# EAGLE design untitled (EAGLE 9.2.0)
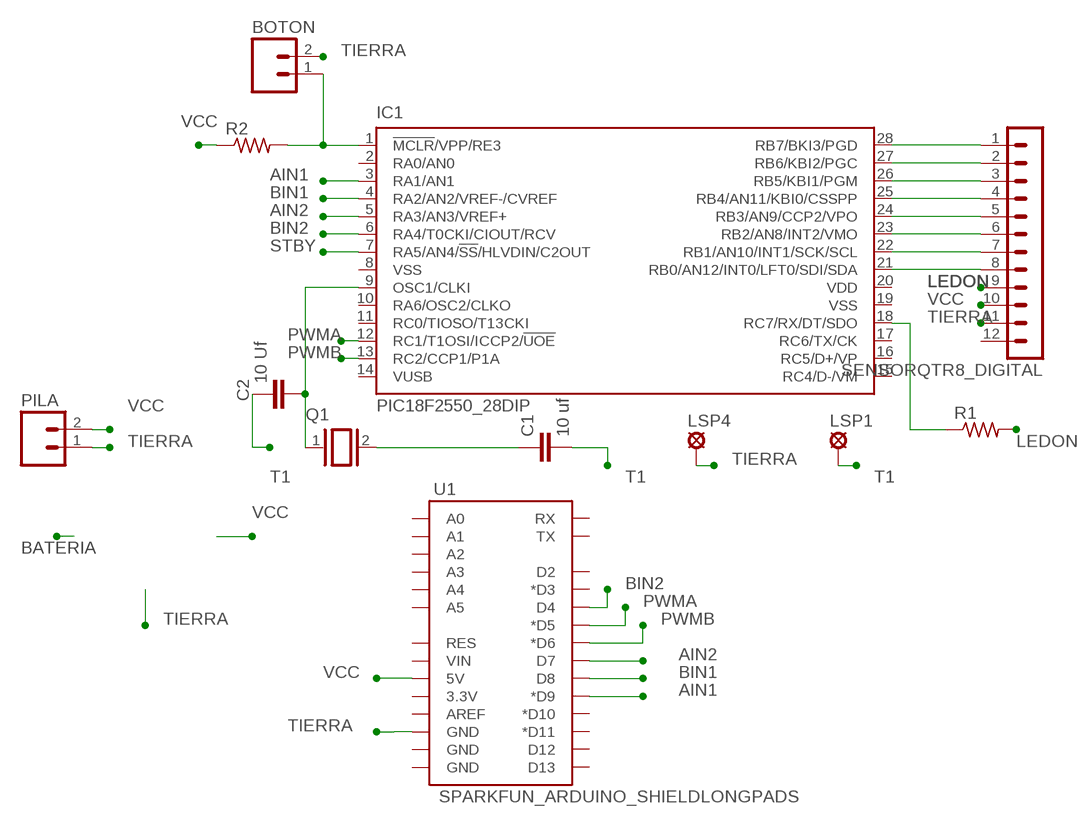
[diagram p0: schematic, sheet 1]

## Parts
BOTON  MA02  [02PA]
C1  10 uf  C-EU025-024X044  [C025-024X044]
C2  10 Uf  C-EU025-024X044  [C025-024X044]
IC1  PIC18F2550_28DIP  [DIL28-3]
LSP1  LSP10  [LSP10]
LSP4  LSP10  [LSP10]
PILA  MA02  [02PA]
Q1  XTAL/S  [QS]
R1  R-US_0204/7  [0204/7]
R2  R-US_0204/7  [0204/7]
SENSORQTR8_DIGITAL  MA12-1  [MA12-1]
U1  SPARKFUN_ARDUINO_SHIELDLONGPADS  [SPARKFUN_DUEMILANOVE_SHIELD_LONGPADS]

## Nets
AIN1: IC1.3(RA1/AN1) U1.D9(*D9)
AIN2: IC1.5(RA3/AN3/VREF+) U1.D7
BIN1: IC1.4(RA2/AN2/VREF-/CVREF) U1.D8
BIN2: IC1.6(RA4/T0CKI/CIOUT/RCV) U1.D4
LEDON: R1.2 SENSORQTR8_DIGITAL.9
N$1: IC1.28(RB7/BKI3/PGD) SENSORQTR8_DIGITAL.1
N$2: IC1.27(RB6/KBI2/PGC) SENSORQTR8_DIGITAL.2
N$3: IC1.26(RB5/KBI1/PGM) SENSORQTR8_DIGITAL.3
N$4: IC1.25(RB4/AN11/KBI0/CSSPP) SENSORQTR8_DIGITAL.4
N$5: IC1.24(RB3/AN9/CCP2/VPO) SENSORQTR8_DIGITAL.5
N$6: IC1.23(RB2/AN8/INT2/VMO) SENSORQTR8_DIGITAL.6
N$7: IC1.22(RB1/AN10/INT1/SCK/SCL) SENSORQTR8_DIGITAL.7
N$8: IC1.21(RB0/AN12/INT0/LFT0/SDI/SDA) SENSORQTR8_DIGITAL.8
N$9: C2.2 IC1.9(OSC1/CLKI) Q1.1
N$10: C1.1 Q1.2
N$11: IC1.18(RC7/RX/DT/SDO) R1.1
N$13: BOTON.1 IC1.1(!MCLR!/VPP/RE3) R2.2
PWMA: IC1.12(RC1/T1OSI/ICCP2/!UOE) U1.D5(*D5)
PWMB: IC1.13(RC2/CCP1/P1A) U1.D6(*D6)
STBY: IC1.7(RA5/AN4/!SS!/HLVDIN/C2OUT)
T1: C1.2 C2.1 LSP1.MP
TIERRA: BOTON.2 LSP4.MP PILA.1 SENSORQTR8_DIGITAL.11 U1.GND@2(GND)
VCC: PILA.2 R2.1 SENSORQTR8_DIGITAL.10 U1.5V
Unconnected: IC1.2(RA0/AN0) IC1.10(RA6/OSC2/CLKO) IC1.11(RC0/TIOSO/T13CKI) IC1.14(VUSB) IC1.15(RC4/D-/VM) IC1.16(RC5/D+/VP) IC1.17(RC6/TX/CK) SENSORQTR8_DIGITAL.12 U1.3.3V U1.A0 U1.A1 U1.A2 U1.A3 U1.A4 U1.A5 U1.AREF U1.D2 U1.D3(*D3) U1.D10(*D10) U1.D11(*D11) U1.D12 U1.D13 U1.GND@0(GND) U1.GND@1(GND) U1.RES U1.RX U1.TX U1.VIN

## Power pins joined to a net without a drawn wire
VDD: IC1.20(VDD)
VSS: IC1.8(VSS) IC1.19(VSS)

## Library data of the parts
BOTON PILA = con-amp-quick:MA02: AMP QUICK CONNECTOR; OC_FARNELL: unknown; OC_NEWARK: unknown
C1 C2 = rcl:C-EU: CAPACITOR, European symbol; SPICEPREFIX: C
IC1 = microchip:PIC18F2*_28: USB Microcontrollers with nanoWatt Technology High-Performance, Enhanced Flash, 28/40/44-Pin, Source: http://ww1.microchip.com/downloads/en/devicedoc/39632c.pdf; MF: MICROCHIP; MPN: PIC18F2550-I/SP; OC_FARNELL: 1523822; OC_NEWARK: 80K6054
LSP1 LSP4 = solpad:LSP10: SOLDER PAD drill 1.0 mm, distributor Buerklin, 12H555
Q1 = special:XTAL/S: CRYSTAL
R1 R2 = rcl:R-US_: RESISTOR, American symbol; SPICEPREFIX: R
SENSORQTR8_DIGITAL = con-lstb:MA12-1: PIN HEADER; OC_FARNELL: unknown; OC_NEWARK: unknown
U1 = MonsterMoto-Shield-v12:SPARKFUN_ARDUINO_SHIELD

## Board
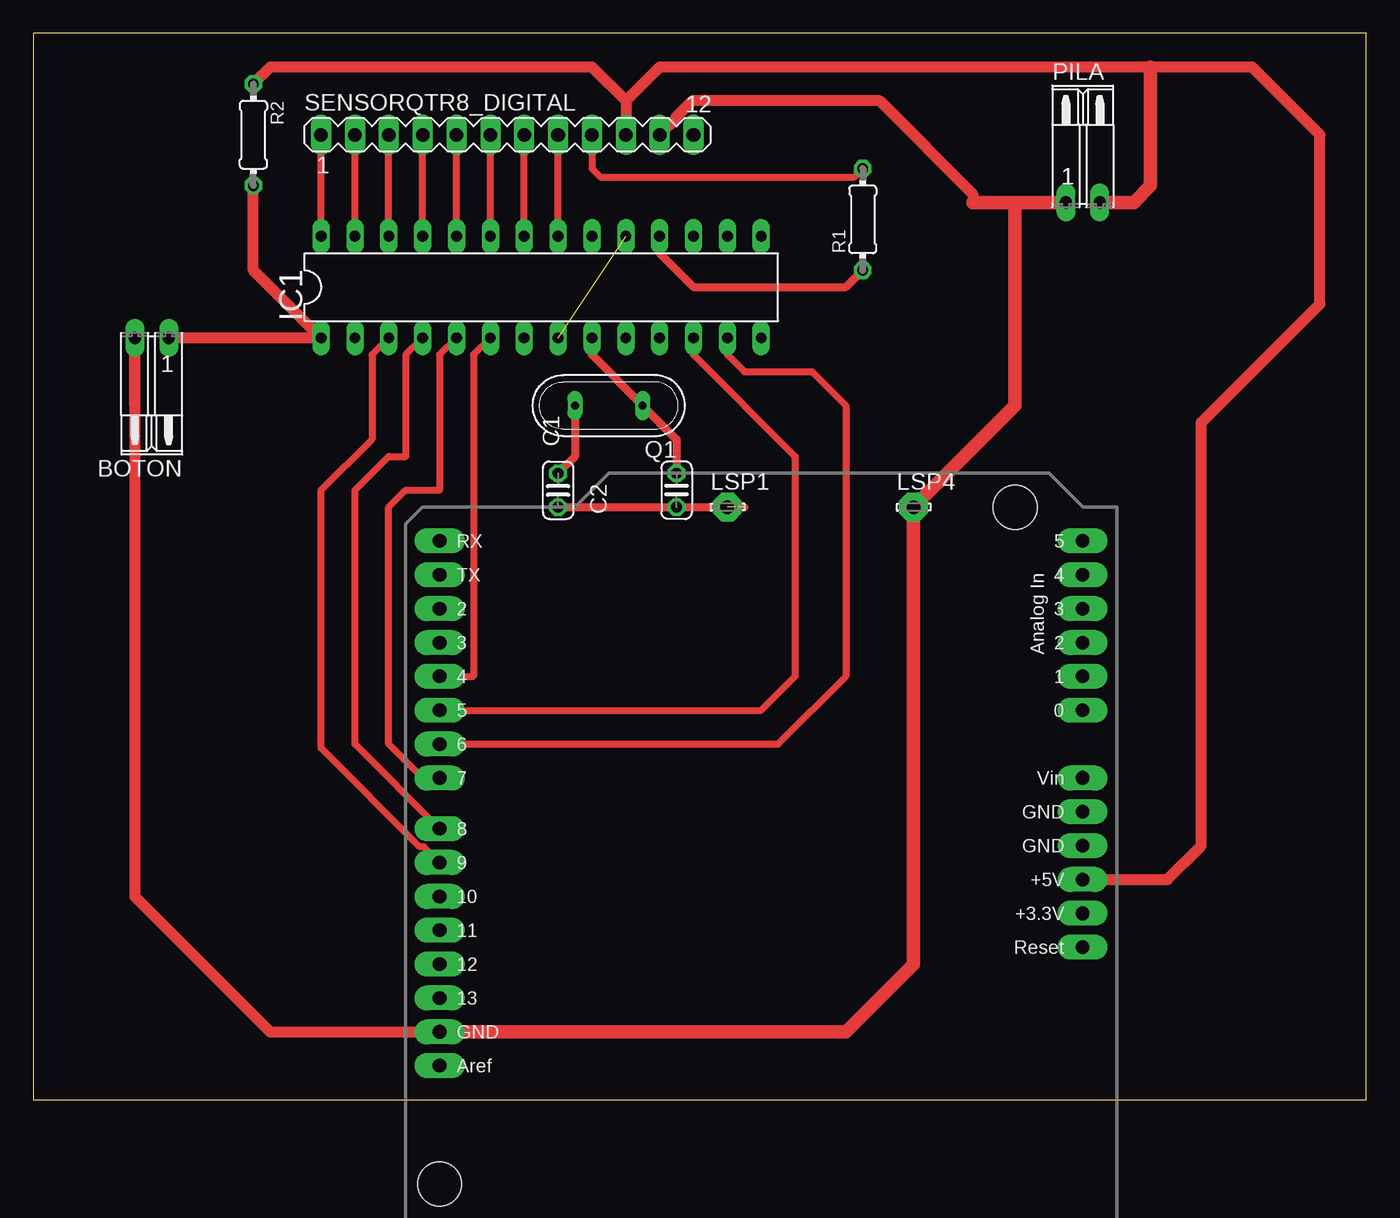
[diagram p1: board, top side]

Size 100 x 80 mm. Coordinates in mm from the lower left corner, seen from the top.
Outline: 0,0 100,0 100,80 0,80 0,0
Copper layers (1*16): Top 0.035mm / dielectric 1.5mm / Bottom 0.035mm
Design rules "default": minimum track width 6mil, minimum drill 0.35mm, track to track 6mil, track to pad 6mil, pad to pad 6mil, via to via 6mil, smd to smd 6mil, copper to edge 40mil, drill to drill 6mil, minimum pad ring 10mil, minimum via ring 8mil, stop-mask expansion 4mil, vias tented up to drill 0mil, thermal gap 10mil

### Footprints (pad centres in the part's own frame; a part is rotated, then mirrored left to right if it is on the bottom)
02PA = drill 0.914 long: 1 -1.27,0; 2 1.27,0
C025-024X044 = drill 0.813 octagon: 1 -1.27,0; 2 1.27,0
DIL28-3 = drill 0.813 long: 1 -16.51,-3.81; 2 -13.97,-3.81; 3 -11.43,-3.81; 4 -8.89,-3.81; 5 -6.35,-3.81; 6 -3.81,-3.81; 7 -1.27,-3.81; 8 1.27,-3.81; 9 3.81,-3.81; 10 6.35,-3.81; 11 8.89,-3.81; 12 11.43,-3.81; 13 13.97,-3.81; 14 16.51,-3.81; 15 16.51,3.81; 16 13.97,3.81; 17 11.43,3.81; 18 8.89,3.81; 19 6.35,3.81; 20 3.81,3.81; 21 1.27,3.81; 22 -1.27,3.81; 23 -3.81,3.81; 24 -6.35,3.81; 25 -8.89,3.81; 26 -11.43,3.81; 27 -13.97,3.81; 28 -16.51,3.81
LSP10 = drill 1.016 pad 2.159 octagon: MP 0,0
QS = drill 0.61 long: 1 -2.54,0; 2 2.54,0
0204/7 = drill 0.813 octagon: 1 -3.81,0; 2 3.81,0
MA12-1 = drill 1.016 long: 1 -13.97,0; 2 -11.43,0; 3 -8.89,0; 4 -6.35,0; 5 -3.81,0; 6 -1.27,0; 7 1.27,0; 8 3.81,0; 9 6.35,0; 10 8.89,0; 11 11.43,0; 12 13.97,0
SPARKFUN_DUEMILANOVE_SHIELD_LONGPADS = drill 1.016 pad 1.88 long: 3.3V 50.8,26.67; 5V 50.8,29.21; A0 50.8,41.91; A1 50.8,44.45; A2 50.8,46.99; A3 50.8,49.53; A4 50.8,52.07; A5 50.8,54.61; AREF 2.54,15.24; D2 2.54,49.53; D3 2.54,46.99; D4 2.54,44.45; D5 2.54,41.91; D6 2.54,39.37; D7 2.54,36.83; D8 2.54,33.02; D9 2.54,30.48; D10 2.54,27.94; D11 2.54,25.4; D12 2.54,22.86; D13 2.54,20.32; GND@0 50.8,31.75; GND@1 50.8,34.29; GND@2 2.54,17.78; RES 50.8,24.13; RX 2.54,54.61; TX 2.54,52.07; VIN 50.8,36.83 | hole 3.302: 45.72,57.15; 2.54,6.35

### Placement (x,y rotation side)
BOTON  8.89,57.15 180 top
C1  39.37,45.72 270 top
C2  48.26,45.72 90 top
IC1  38.1,60.96 0 top
LSP1  52.07,44.45 0 top
LSP4  66.04,44.45 0 top
PILA  78.74,67.31 0 top
Q1  43.18,52.07 180 top
R1  62.23,66.04 90 top
R2  16.51,72.39 270 top
SENSORQTR8_DIGITAL  35.56,72.39 0 top
U1  27.94,-12.7 0 top

### Tracks (layer width: path | path; a pad name or v marks a point on that pad's centre or on a via)
AIN1
  Top 0.508: U1.D9 29.29,18.97 28.98,18.97 21.59,26.37 21.59,45.72 25.4,49.53 25.4,55.88 IC1.3
AIN2
  Top 0.508: U1.D7 29.21,24.13 26.67,26.67 26.67,44.45 27.94,45.72 30.48,45.72 30.48,55.88 IC1.5
BIN1
  Top 0.508: U1.D8 24.13,26.67 24.13,45.72 26.67,48.26 27.94,48.26 27.94,55.88 IC1.4
BIN2
  Top 0.508: U1.D4 33.02,31.75 33.02,55.88 IC1.6
LEDON
  Top 0.508: SENSORQTR8_DIGITAL.9 41.91,69.85 42.55,69.22 61.59,69.22 R1.2
N$1
  Top 0.152: SENSORQTR8_DIGITAL.1 21.59,66.04
  Top 0.508: IC1.28 SENSORQTR8_DIGITAL.1
N$2
  Top 0.508: IC1.27 SENSORQTR8_DIGITAL.2
N$3
  Top 0.508: IC1.26 SENSORQTR8_DIGITAL.3
N$4
  Top 0.508: IC1.25 SENSORQTR8_DIGITAL.4
N$5
  Top 0.508: IC1.24 SENSORQTR8_DIGITAL.5
N$6
  Top 0.508: IC1.23 SENSORQTR8_DIGITAL.6
N$7
  Top 0.508: IC1.22 SENSORQTR8_DIGITAL.7
N$8
  Top 0.508: IC1.21 SENSORQTR8_DIGITAL.8
N$9
  Top 0.61: IC1.9 41.91,55.88 Q1.1 48.26,49.53 C2.2
N$10
  Top 0.61: Q1.2 40.64,48.26 C1.1
N$11
  Top 0.61: IC1.18 46.99,63.5 49.53,60.96 60.96,60.96 R1.1
N$13
  Top 0.813: R2.2 16.51,62.23 IC1.1 BOTON.1
PWMA
  Top 0.508: U1.D5 54.61,29.21 57.15,31.75 57.15,48.26 49.53,55.88 IC1.12
PWMB
  Top 0.508: U1.D6 55.88,26.67 60.96,31.75 60.96,52.07 58.42,54.61 53.34,54.61 52.07,55.88 IC1.13
T1  (1 unrouted)
  Top 0.61: C1.2 C2.1 53.34,44.45
TIERRA
  Top 0.152: 8.19,57.15 BOTON.2
  Top 0.508: 63.5,74.93 68.58,69.85
  Top 0.813: 7.62,52.07 BOTON.2 7.62,15.24 17.78,5.08 U1.GND@2 | SENSORQTR8_DIGITAL.11 48.21,73.61 48.21,73.7 49.44,74.93 63.5,74.93 70.48,67.94 70.48,67.31
  Top 1.016: PILA.1 73.66,67.31 | 73.66,67.31 70.48,67.31 | 73.66,67.31 73.66,52.07 LSP4.MP 66.04,10.16 60.96,5.08 U1.GND@2
VCC
  Top 0.406: SENSORQTR8_DIGITAL.10 44.45,73.66
  Top 0.813: 44.45,74.93 41.91,77.47 17.78,77.47 R2.1 | U1.5V 85.09,16.51 87.63,19.05 87.63,50.8 96.52,59.69 96.52,72.39 91.44,77.47 83.82,77.47 46.99,77.47 44.45,74.93 | 44.45,74.93 SENSORQTR8_DIGITAL.10
  Top 1.016: PILA.2 82.55,67.31 83.82,68.58 83.82,77.47
VSS  (1 unrouted)